# Altium project SFCMasterC.PrjPCB
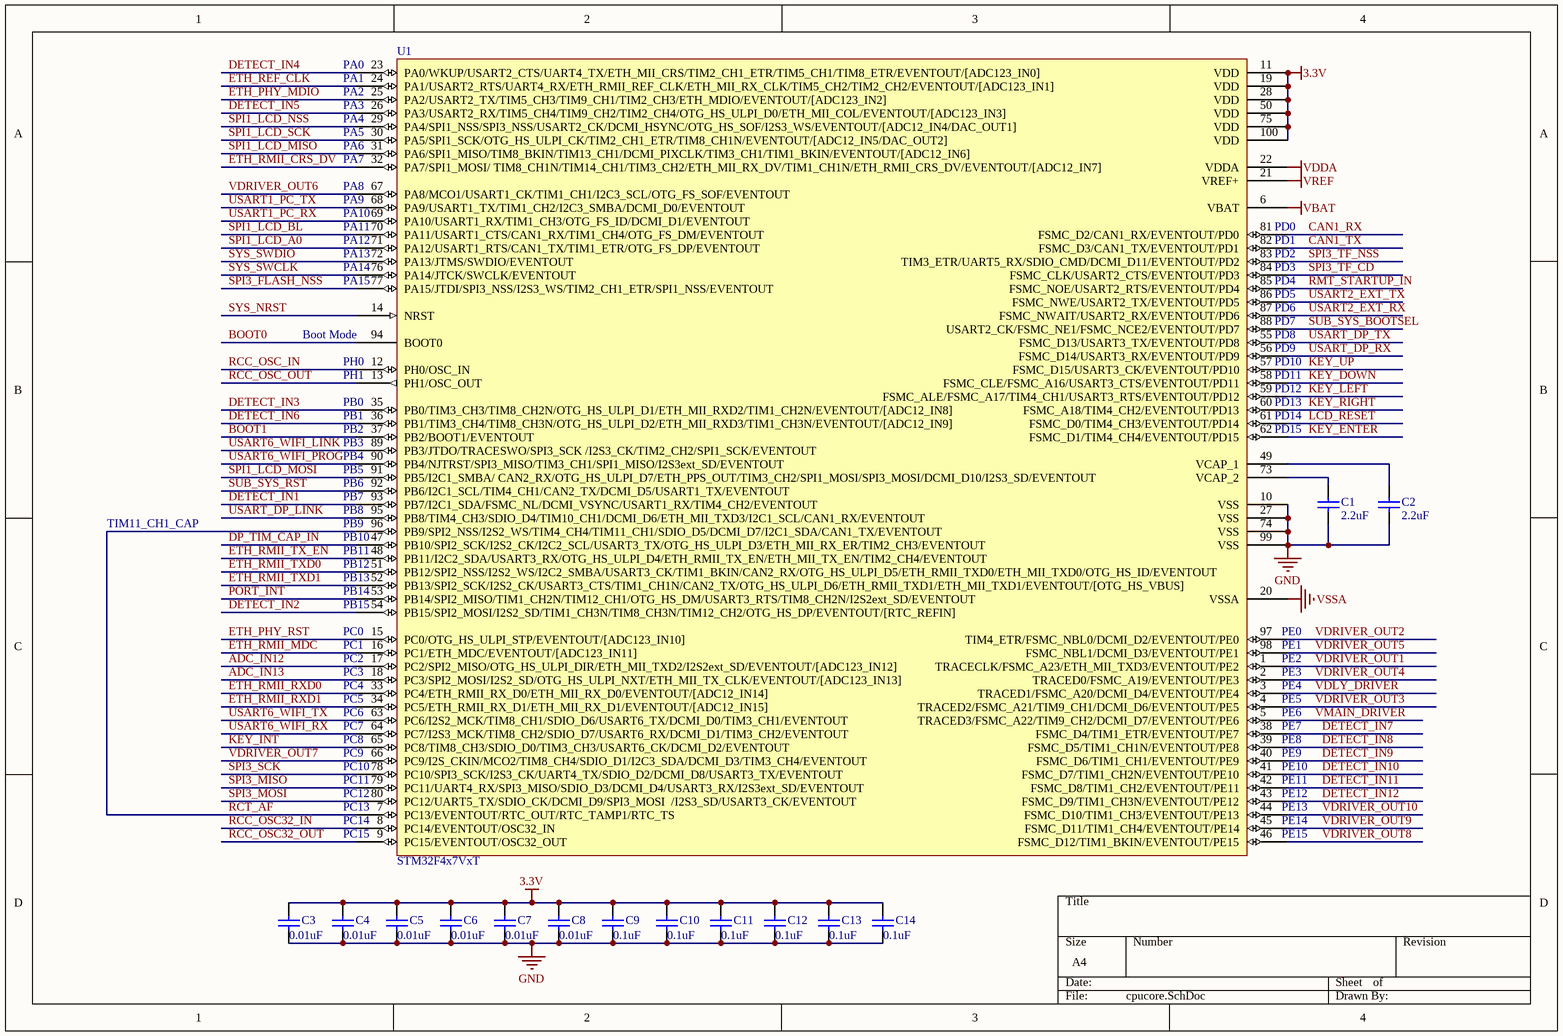
[diagram p0: cpucore.SchDoc]
6 sheets, 178 parts. Net scope: global (net labels, ports and power ports of the same name join across sheets).
Board file: SFCmasterC.PcbDoc
Sheets:
  cpucore.SchDoc
  cpuinterface.SchDoc
  cpuledin.SchDoc
  cpuledout.SchDoc
  cpuadcinput.SchDoc
  cpupwrbackup.SchDoc

## Sheet cpucore.SchDoc
size A4

### Parts
C1  2.2uF  [CAPC2012M]
C2  2.2uF  [CAPC2012M]
C3  0.01uF  [CAPC2012M]
C4  0.01uF  [CAPC2012M]
C5  0.01uF  [CAPC2012M]
C6  0.01uF  [CAPC2012M]
C7  0.01uF  [CAPC2012M]
C8  0.01uF  [CAPC2012M]
C9  0.1uF  [CAPC2012M]
C10  0.1uF  [CAPC2012M]
C11  0.1uF  [CAPC2012M]
C12  0.1uF  [CAPC2012M]
C13  0.1uF  [CAPC2012M]
C14  0.1uF  [CAPC2012M]
U1  STM32F4x7VxT  [LQFP100_L]

### Nets
3.3V: C3.2 C4.2 C5.2 C6.2 C7.2 C8.2 C9.2 C10.2 C11.2 C12.2 C13.2 C14.2 U1.11(VDD) U1.19(VDD) U1.28(VDD) U1.50(VDD) U1.75(VDD) U1.100(VDD)
GND: C1.2 C2.2 C3.1 C4.1 C5.1 C6.1 C7.1 C8.1 C9.1 C10.1 C11.1 C12.1 C13.1 C14.1 U1.10(VSS) U1.20(VSSA) U1.27(VSS) U1.74(VSS) U1.99(VSS)  [also labelled VSSA]
VBAT: U1.6(VBAT)
VDDA: U1.22(VDDA)
VREF: U1.21(VREF+)
ADC_IN12: U1.17(PC2/SPI2_MISO/OTG_HS_ULPI_DIR/ETH_MII_TXD2/I2S2ext_SD/EVENTOUT/[ADC123_IN12])
ADC_IN13: U1.18(PC3/SPI2_MOSI/I2S2_SD/OTG_HS_ULPI_NXT/ETH_MII_TX_CLK/EVENTOUT/[ADC123_IN13])
BOOT0: U1.94(BOOT0)
BOOT1: U1.37(PB2/BOOT1/EVENTOUT)
CAN1_RX: U1.81(FSMC_D2/CAN1_RX/EVENTOUT/PD0)
CAN1_TX: U1.82(FSMC_D3/CAN1_TX/EVENTOUT/PD1)
DETECT_IN1: U1.93(PB7/I2C1_SDA/FSMC_NL/DCMI_VSYNC/USART1_RX/TIM4_CH2/EVENTOUT)
DETECT_IN2: U1.54(PB15/SPI2_MOSI/I2S2_SD/TIM1_CH3N/TIM8_CH3N/TIM12_CH2/OTG_HS_DP/EVENTOUT/[RTC_REFIN])
DETECT_IN3: U1.35(PB0/TIM3_CH3/TIM8_CH2N/OTG_HS_ULPI_D1/ETH_MII_RXD2/TIM1_CH2N/EVENTOUT/[ADC12_IN8])
DETECT_IN4: U1.23(PA0/WKUP/USART2_CTS/UART4_TX/ETH_MII_CRS/TIM2_CH1_ETR/TIM5_CH1/TIM8_ETR/EVENTOUT/[ADC123_IN0])
DETECT_IN5: U1.26(PA3/USART2_RX/TIM5_CH4/TIM9_CH2/TIM2_CH4/OTG_HS_ULPI_D0/ETH_MII_COL/EVENTOUT/[ADC123_IN3])
DETECT_IN6: U1.36(PB1/TIM3_CH4/TIM8_CH3N/OTG_HS_ULPI_D2/ETH_MII_RXD3/TIM1_CH3N/EVENTOUT/[ADC12_IN9])
DETECT_IN7: U1.38(FSMC_D4/TIM1_ETR/EVENTOUT/PE7)
DETECT_IN8: U1.39(FSMC_D5/TIM1_CH1N/EVENTOUT/PE8)
DETECT_IN9: U1.40(FSMC_D6/TIM1_CH1/EVENTOUT/PE9)
DETECT_IN10: U1.41(FSMC_D7/TIM1_CH2N/EVENTOUT/PE10)
DETECT_IN11: U1.42(FSMC_D8/TIM1_CH2/EVENTOUT/PE11)
DETECT_IN12: U1.43(FSMC_D9/TIM1_CH3N/EVENTOUT/PE12)
DP_TIM_CAP_IN: U1.47(PB10/SPI2_SCK/I2S2_CK/I2C2_SCL/USART3_TX/OTG_HS_ULPI_D3/ETH_MII_RX_ER/TIM2_CH3/EVENTOUT)
ETH_PHY_MDIO: U1.25(PA2/USART2_TX/TIM5_CH3/TIM9_CH1/TIM2_CH3/ETH_MDIO/EVENTOUT/[ADC123_IN2])
ETH_PHY_RST: U1.15(PC0/OTG_HS_ULPI_STP/EVENTOUT/[ADC123_IN10])
ETH_REF_CLK: U1.24(PA1/USART2_RTS/UART4_RX/ETH_RMII_REF_CLK/ETH_MII_RX_CLK/TIM5_CH2/TIM2_CH2/EVENTOUT/[ADC123_IN1])
ETH_RMII_CRS_DV: U1.32(PA7/SPI1_MOSI/_TIM8_CH1N/TIM14_CH1/TIM3_CH2/ETH_MII_RX_DV/TIM1_CH1N/ETH_RMII_CRS_DV/EVENTOUT/[ADC12_IN7])
ETH_RMII_MDC: U1.16(PC1/ETH_MDC/EVENTOUT/[ADC123_IN11])
ETH_RMII_RXD0: U1.33(PC4/ETH_RMII_RX_D0/ETH_MII_RX_D0/EVENTOUT/[ADC12_IN14])
ETH_RMII_RXD1: U1.34(PC5/ETH_RMII_RX_D1/ETH_MII_RX_D1/EVENTOUT/[ADC12_IN15])
ETH_RMII_TX_EN: U1.48(PB11/I2C2_SDA/USART3_RX/OTG_HS_ULPI_D4/ETH_RMII_TX_EN/ETH_MII_TX_EN/TIM2_CH4/EVENTOUT)
ETH_RMII_TXD0: U1.51(PB12/SPI2_NSS/I2S2_WS/I2C2_SMBA/USART3_CK/TIM1_BKIN/CAN2_RX/OTG_HS_ULPI_D5/ETH_RMII_TXD0/ETH_MII_TXD0/OTG_HS_ID/EVENTOUT)
ETH_RMII_TXD1: U1.52(PB13/SPI2_SCK/I2S2_CK/USART3_CTS/TIM1_CH1N/CAN2_TX/OTG_HS_ULPI_D6/ETH_RMII_TXD1/ETH_MII_TXD1/EVENTOUT/[OTG_HS_VBUS])
KEY_DOWN: U1.58(FSMC_CLE/FSMC_A16/USART3_CTS/EVENTOUT/PD11)
KEY_ENTER: U1.62(FSMC_D1/TIM4_CH4/EVENTOUT/PD15)
KEY_INT: U1.65(PC8/TIM8_CH3/SDIO_D0/TIM3_CH3/USART6_CK/DCMI_D2/EVENTOUT)
KEY_LEFT: U1.59(FSMC_ALE/FSMC_A17/TIM4_CH1/USART3_RTS/EVENTOUT/PD12)
KEY_RIGHT: U1.60(FSMC_A18/TIM4_CH2/EVENTOUT/PD13)
KEY_UP: U1.57(FSMC_D15/USART3_CK/EVENTOUT/PD10)
LCD_RESET: U1.61(FSMC_D0/TIM4_CH3/EVENTOUT/PD14)
PORT_INT: U1.53(PB14/SPI2_MISO/TIM1_CH2N/TIM12_CH1/OTG_HS_DM/USART3_RTS/TIM8_CH2N/I2S2ext_SD/EVENTOUT)
RCC_OSC32_IN: U1.8(PC14/EVENTOUT/OSC32_IN)
RCC_OSC32_OUT: U1.9(PC15/EVENTOUT/OSC32_OUT)
RCC_OSC_IN: U1.12(PH0/OSC_IN)
RCC_OSC_OUT: U1.13(PH1/OSC_OUT)
RCT_AF: U1.7(PC13/EVENTOUT/RTC_OUT/RTC_TAMP1/RTC_TS) U1.96(PB9/SPI2_NSS/I2S2_WS/TIM4_CH4/TIM11_CH1/SDIO_D5/DCMI_D7/I2C1_SDA/CAN1_TX/EVENTOUT)
RMT_STARTUP_IN: U1.85(FSMC_NOE/USART2_RTS/EVENTOUT/PD4)
SPI1_LCD_A0: U1.71(PA12/USART1_RTS/CAN1_TX/TIM1_ETR/OTG_FS_DP/EVENTOUT)
SPI1_LCD_BL: U1.70(PA11/USART1_CTS/CAN1_RX/TIM1_CH4/OTG_FS_DM/EVENTOUT)
SPI1_LCD_MISO: U1.31(PA6/SPI1_MISO/TIM8_BKIN/TIM13_CH1/DCMI_PIXCLK/TIM3_CH1/TIM1_BKIN/EVENTOUT/[ADC12_IN6])
SPI1_LCD_MOSI: U1.91(PB5/I2C1_SMBA/_CAN2_RX/OTG_HS_ULPI_D7/ETH_PPS_OUT/TIM3_CH2/SPI1_MOSI/SPI3_MOSI/DCMI_D10/I2S3_SD/EVENTOUT)
SPI1_LCD_NSS: U1.29(PA4/SPI1_NSS/SPI3_NSS/USART2_CK/DCMI_HSYNC/OTG_HS_SOF/I2S3_WS/EVENTOUT/[ADC12_IN4/DAC_OUT1])
SPI1_LCD_SCK: U1.30(PA5/SPI1_SCK/OTG_HS_ULPI_CK/TIM2_CH1_ETR/TIM8_CH1N/EVENTOUT/[ADC12_IN5/DAC_OUT2])
SPI3_FLASH_NSS: U1.77(PA15/JTDI/SPI3_NSS/I2S3_WS/TIM2_CH1_ETR/SPI1_NSS/EVENTOUT)
SPI3_MISO: U1.79(PC11/UART4_RX/SPI3_MISO/SDIO_D3/DCMI_D4/USART3_RX/I2S3ext_SD/EVENTOUT)
SPI3_MOSI: U1.80(PC12/UART5_TX/SDIO_CK/DCMI_D9/SPI3_MOSI__/I2S3_SD/USART3_CK/EVENTOUT)
SPI3_SCK: U1.78(PC10/SPI3_SCK/I2S3_CK/UART4_TX/SDIO_D2/DCMI_D8/USART3_TX/EVENTOUT)
SPI3_TF_CD: U1.84(FSMC_CLK/USART2_CTS/EVENTOUT/PD3)
SPI3_TF_NSS: U1.83(TIM3_ETR/UART5_RX/SDIO_CMD/DCMI_D11/EVENTOUT/PD2)
SUB_SYS_BOOTSEL: U1.88(USART2_CK/FSMC_NE1/FSMC_NCE2/EVENTOUT/PD7)
SUB_SYS_RST: U1.92(PB6/I2C1_SCL/TIM4_CH1/CAN2_TX/DCMI_D5/USART1_TX/EVENTOUT)
SYS_NRST: U1.14(NRST)
SYS_SWCLK: U1.76(PA14/JTCK/SWCLK/EVENTOUT)
SYS_SWDIO: U1.72(PA13/JTMS/SWDIO/EVENTOUT)
USART1_PC_RX: U1.69(PA10/USART1_RX/TIM1_CH3/OTG_FS_ID/DCMI_D1/EVENTOUT)
USART1_PC_TX: U1.68(PA9/USART1_TX/TIM1_CH2/I2C3_SMBA/DCMI_D0/EVENTOUT)
USART2_EXT_RX: U1.87(FSMC_NWAIT/USART2_RX/EVENTOUT/PD6)
USART2_EXT_TX: U1.86(FSMC_NWE/USART2_TX/EVENTOUT/PD5)
USART6_WIFI_LINK: U1.89(PB3/JTDO/TRACESWO/SPI3_SCK_/I2S3_CK/TIM2_CH2/SPI1_SCK/EVENTOUT)
USART6_WIFI_PROG: U1.90(PB4/NJTRST/SPI3_MISO/TIM3_CH1/SPI1_MISO/I2S3ext_SD/EVENTOUT)
USART6_WIFI_RX: U1.64(PC7/I2S3_MCK/TIM8_CH2/SDIO_D7/USART6_RX/DCMI_D1/TIM3_CH2/EVENTOUT)
USART6_WIFI_TX: U1.63(PC6/I2S2_MCK/TIM8_CH1/SDIO_D6/USART6_TX/DCMI_D0/TIM3_CH1/EVENTOUT)
USART_DP_LINK: U1.95(PB8/TIM4_CH3/SDIO_D4/TIM10_CH1/DCMI_D6/ETH_MII_TXD3/I2C1_SCL/CAN1_RX/EVENTOUT)
USART_DP_RX: U1.56(FSMC_D14/USART3_RX/EVENTOUT/PD9)
USART_DP_TX: U1.55(FSMC_D13/USART3_TX/EVENTOUT/PD8)
VDLY_DRIVER: U1.3(TRACED1/FSMC_A20/DCMI_D4/EVENTOUT/PE4)
VDRIVER_OUT1: U1.1(TRACECLK/FSMC_A23/ETH_MII_TXD3/EVENTOUT/PE2)
VDRIVER_OUT2: U1.97(TIM4_ETR/FSMC_NBL0/DCMI_D2/EVENTOUT/PE0)
VDRIVER_OUT3: U1.4(TRACED2/FSMC_A21/TIM9_CH1/DCMI_D6/EVENTOUT/PE5)
VDRIVER_OUT4: U1.2(TRACED0/FSMC_A19/EVENTOUT/PE3)
VDRIVER_OUT5: U1.98(FSMC_NBL1/DCMI_D3/EVENTOUT/PE1)
VDRIVER_OUT6: U1.67(PA8/MCO1/USART1_CK/TIM1_CH1/I2C3_SCL/OTG_FS_SOF/EVENTOUT)
VDRIVER_OUT7: U1.66(PC9/I2S_CKIN/MCO2/TIM8_CH4/SDIO_D1/I2C3_SDA/DCMI_D3/TIM3_CH4/EVENTOUT)
VDRIVER_OUT8: U1.46(FSMC_D12/TIM1_BKIN/EVENTOUT/PE15)
VDRIVER_OUT9: U1.45(FSMC_D11/TIM1_CH4/EVENTOUT/PE14)
VDRIVER_OUT10: U1.44(FSMC_D10/TIM1_CH3/EVENTOUT/PE13)
VMAIN_DRIVER: U1.5(TRACED3/FSMC_A22/TIM9_CH2/DCMI_D7/EVENTOUT/PE6)
NetC1_1: C1.1 U1.73(VCAP_2)
NetC2_1: C2.1 U1.49(VCAP_1)

### Notes on the sheet
- (near U1) PA0
- (near U1) PA1
- (near U1) PA2
- (near U1) PA3
- (near U1) PA4
- (near U1) PA5
- (near U1) PA6
- (near U1) PA7
- (near U1) PA8
- (near U1) PA9
- (near U1) PA10
- (near U1) PA11
- (near U1) PA12
- (near U1) PD1
- (near U1) PD0
- (near U1) PA13
- (near U1) PA14
- (near U1) PA15
- (near U1) PD3
- (near U1) PD5
- (near U1) PD2
- (near U1) PD4
- (near U1) PD6
- (near U1) Boot Mode
- (near U1) PH1
- (near U1) PH0
- (near U1) PD11
- (near U1) PD10
- (near U1) PD9
- (near U1) PD8
- (near U1) PD7
- (near U1) PB2
- (near U1) PB3
- (near U1) PB0
- (near U1) PB1
- (near U1) PD12
- (near U1) PD13
- (near U1) PD14
- (near U1) PD15
- (near U1) PB4
- (near U1) PB5
- (near U1) PB6
- (near U1) PB7
- (near U1) PB8
- TIM11_CH1_CAP
- (near U1) PB11
- (near U1) PB12
- (near U1) PB13
- (near U1) PB10
- (near U1) PB9
- (near U1) PB14
- (near U1) PB15
- (near U1) PC0
- (near U1) PC1
- (near U1) PE0
- (near U1) PE1
- (near U1) PC4
- (near U1) PC5
- (near U1) PC2
- (near U1) PC3
- (near U1) PC6
- (near U1) PE2
- (near U1) PE3
- (near U1) PE4
- (near U1) PE5
- (near U1) PE6
- (near U1) PC10
- (near U1) PC11
- (near U1) PC7
- (near U1) PC8
- (near U1) PC9
- (near U1) PE7
- (near U1) PE8
- (near U1) PE9
- (near U1) PE10
- (near U1) PE11
- (near U1) PC14
- (near U1) PC15
- (near U1) PC12
- (near U1) PC13
- (near U1) PE12
- (near U1) PE13
- (near U1) PE14
- (near U1) PE15

### Library data of the parts
C1-C14 = Cap: Capacitor; Value: 1nF; Published: 8-Jun-2000; LatestRevisionDate: 17-Jul-2002; LatestRevisionNote: Re-released for DXP Platform.; PackageReference: RAD-0.3; Publisher: Altium Limited
U1 = STM32F4x7VxT: STM32 ARM-based 32-bit MCU with 64 Kbytes Flash, 100-pin LQFP, Industrial Temperature; ComponentLink1Description: Manufacturer Link; ComponentLink2Description: Datasheet; ComponentLink2URL: http://www.st.com/stonline/products/literature/ds/13587.pdf; DatasheetVersion: rev6, Mar-2008; PackageDescription: 100-Pin Low-Profile Quad Flat Pack, 14 x 14 mm Body, 0.5 mm Pitch (LQFP100); PackageReference: LQFP100; PackageVersion: Mar-2008; Published: 30-May-2008; Publisher: Altium Limited; ComponentLink1URL: www.st.com/stm32

## Sheet cpuinterface.SchDoc
size A4
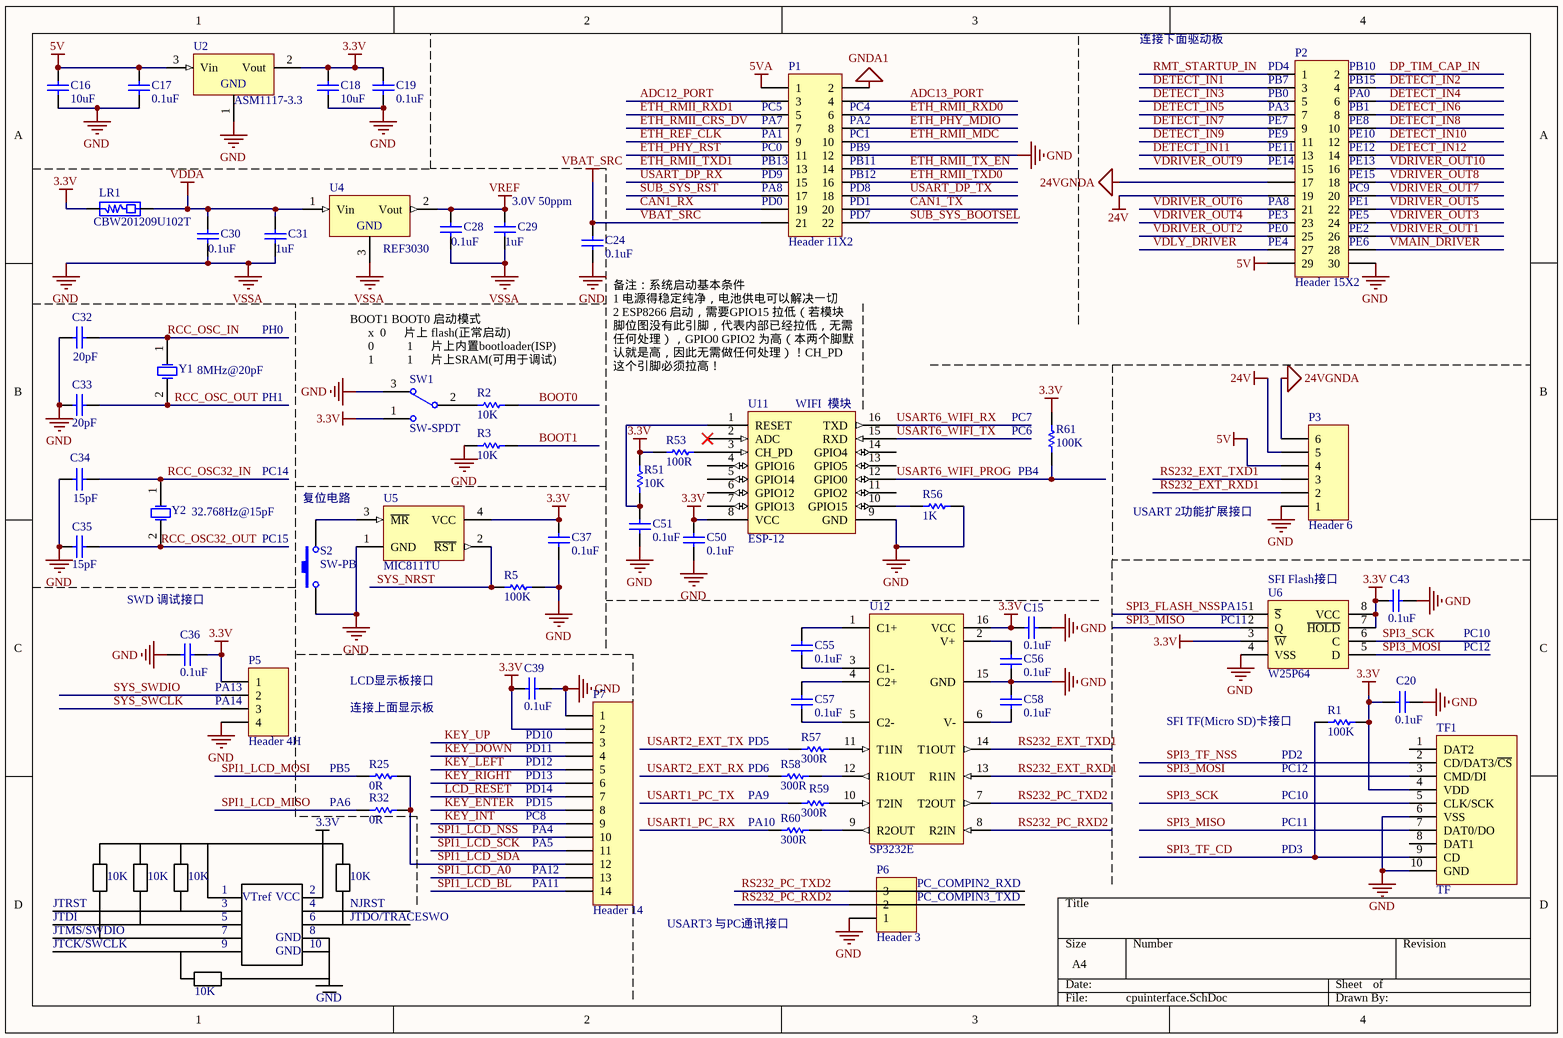
[diagram p1: cpuinterface.SchDoc]

### Parts
C15  0.1uF  [CAPC2012M]
C16  10uF  [CAPC2012M]
C17  0.1uF  [CAPC2012M]
C18  10uF  [CAPC2012M]
C19  0.1uF  [CAPC2012M]
C20  0.1uF  [CAPC2012M]
C24  0.1uF  [CAPC2012M]
C28  0.1uF  [CAPC2012M]
C29  1uF  [CAPC2012M]
C30  0.1uF  [CAPC2012M]
C31  1uF  [CAPC2012M]
C32  20pF  [CAPC2012M]
C33  20pF  [CAPC2012M]
C34  15pF  [CAPC2012M]
C35  15pF  [CAPC2012M]
C36  0.1uF  [CAPC2012M]
C37  0.1uF  [CAPC2012M]
C39  0.1uF  [CAPC2012M]
C43  0.1uF  [CAPC2012M]
C50  0.1uF  [CAPC2012M]
C51  0.1uF  [CAPC2012M]
C55  0.1uF  [CAPC2012M]
C56  0.1uF  [CAPC2012M]
C57  0.1uF  [CAPC2012M]
C58  0.1uF  [CAPC2012M]
LR1  CBW201209U102T  [INDC2012M]
P1  Header 11X2  [HDR2X11]
P2  Header 15X2  [HDR2X15]
P3  Header 6  [HDR1x6-2.0]
P5  Header 4H  [HDR1X4H-2.0]
P6  Header 3  [HDR1x3-2.0]
P7  Header 14  [FPC0.5-14P-A]
R1  100K  [RESC2012M]
R2  10K  [RESC2012M]
R3  10K  [RESC2012M]
R5  100K  [RESC2012M]
R25  0R  [RESC2012M]
R32  0R  [RESC2012M]
R51  10K  [RESC2012M]
R53  100R  [RESC2012M]
R56  1K  [RESC2012M]
R57  300R  [RESC2012M]
R58  300R  [RESC2012M]
R59  300R  [RESC2012M]
R60  300R  [RESC2012M]
R61  100K  [RESC2012M]
S2  SW-PB  [PBSMT-6x3x3.5R]
SW1  SW-SPDT  [SW-9x3.5x3.5RS]
TF1  TF  [TF-PUSH]
U2  ASM1117-3.3  [SOT-223]
U4  REF3030  [SOT23_M]
U5  MIC811TU  [SOT-143_N]
U6  W25P64  [SOIC8_W]
U11  ESP-12  [ESP-12]
U12  SP3232E  [NSO16_M]
Y1  8MHz@20pF  [HC-49U]
Y2  32.768Hz@15pF  [HC-RTC-L]

### Nets
3.3V: C15.2 C18.2 C19.2 C20.1 C36.2 C37.2 C39.2 C43.1 C50.1 LR1.1 P5.1 P7.2 R1.2 R51.1 R53.1 R61.1 SW1.1 TF1.4(VDD) U2.2(Vout) U5.4(VCC) U6.3(~{W}) U6.7(~{HOLD}) U6.8(VCC) U11.8(VCC) U12.16(VCC)
5V: C16.2 C17.2 P2.29 P3.4 U2.3(Vin)
5VA: P1.1
24V: P2.19 P3.5
24VGNDA: P2.17 P3.6
GND: C15.1 C16.1 C17.1 C18.1 C19.1 C20.2 C24.2 C28.1 C29.1 C30.1 C31.1 C32.2 C33.2 C34.2 C35.2 C36.1 C37.1 C39.1 C43.2 C50.2 C51.2 C56.1 C58.2 P1.12 P2.30 P3.1 P5.4 P6.1 P7.1 R3.2 R5.2 R56.1 S2.1 SW1.3 TF1.6(VSS) TF1.10(GND) U2.1(GND) U4.3(GND) U5.1(GND) U6.4(VSS) U11.9(GND) U12.15(GND)  [also labelled VSSA]
GNDA1: P1.2  [project net GNDA]
VBAT_SRC: C24.1 P1.21
VDDA: C30.2 C31.2 LR1.2 U4.1(Vin)
VREF: C28.2 C29.2 U4.2(Vout)
ADC12_PORT: P1.3
ADC13_PORT: P1.4
BOOT0: R2.1
BOOT1: R3.1
CAN1_RX: P1.19
CAN1_TX: P1.20
DETECT_IN1: P2.3
DETECT_IN2: P2.4
DETECT_IN3: P2.5
DETECT_IN4: P2.6
DETECT_IN5: P2.7
DETECT_IN6: P2.8
DETECT_IN7: P2.9
DETECT_IN8: P2.10
DETECT_IN9: P2.11
DETECT_IN10: P2.12
DETECT_IN11: P2.13
DETECT_IN12: P2.14
DP_TIM_CAP_IN: P2.2
ETH_PHY_MDIO: P1.8
ETH_PHY_RST: P1.11
ETH_REF_CLK: P1.9
ETH_RMII_CRS_DV: P1.7
ETH_RMII_MDC: P1.10
ETH_RMII_RXD0: P1.6
ETH_RMII_RXD1: P1.5
ETH_RMII_TX_EN: P1.14
ETH_RMII_TXD0: P1.16
ETH_RMII_TXD1: P1.13
KEY_DOWN: P7.4
KEY_ENTER: P7.8
KEY_INT: P7.9
KEY_LEFT: P7.5
KEY_RIGHT: P7.6
KEY_UP: P7.3
LCD_RESET: P7.7
RCC_OSC32_IN: C34.1 Y2.1(OSC1)
RCC_OSC32_OUT: C35.1 Y2.2(OSC2)
RCC_OSC_IN: C32.1 Y1.1(OSC1)
RCC_OSC_OUT: C33.1 Y1.2(OSC2)
RMT_STARTUP_IN: P2.1
RS232_EXT_RXD1: P3.2 U12.13(R1IN)
RS232_EXT_TXD1: P3.3 U12.14(T1OUT)
RS232_PC_RXD2: P6.2 U12.8(R2IN)
RS232_PC_TXD2: P6.3 U12.7(T2OUT)
SPI1_LCD_A0: P7.13
SPI1_LCD_BL: P7.14
SPI1_LCD_MISO: R32.1
SPI1_LCD_MOSI: R25.1
SPI1_LCD_NSS: P7.10
SPI1_LCD_SCK: P7.11
SPI1_LCD_SDA: P7.12 R25.2 R32.2
SPI3_FLASH_NSS: U6.1(~{S})
SPI3_MISO: TF1.7(DAT0/DO) U6.2(Q)
SPI3_MOSI: TF1.3(CMD/DI) U6.5(D)
SPI3_SCK: TF1.5(CLK/SCK) U6.6(C)
SPI3_TF_CD: R1.1 TF1.9(CD)
SPI3_TF_NSS: TF1.2(CD/DAT3/~{CS})
SUB_SYS_BOOTSEL: P1.22
SUB_SYS_RST: P1.17
SYS_NRST: R5.1 U5.2(~{RST})
SYS_SWCLK: P5.3
SYS_SWDIO: P5.2
USART1_PC_RX: R60.2
USART1_PC_TX: R59.1
USART2_EXT_RX: R58.1
USART2_EXT_TX: R57.1
USART6_WIFI_PROG: R61.2 U11.12(GPIO0)
USART6_WIFI_RX: U11.16(TXD)
USART6_WIFI_TX: U11.15(RXD)
USART_DP_RX: P1.15
USART_DP_TX: P1.18
VDLY_DRIVER: P2.27
VDRIVER_OUT1: P2.26
VDRIVER_OUT2: P2.25
VDRIVER_OUT3: P2.24
VDRIVER_OUT4: P2.23
VDRIVER_OUT5: P2.22
VDRIVER_OUT6: P2.21
VDRIVER_OUT7: P2.20
VDRIVER_OUT8: P2.18
VDRIVER_OUT9: P2.15
VDRIVER_OUT10: P2.16
VMAIN_DRIVER: P2.28
NetC51_1: C51.1 R51.2 U11.1(RESET)
NetC55_1: C55.1 U12.1(C1+)
NetC55_2: C55.2 U12.3(C1-)
NetC56_2: C56.2 U12.2(V+)
NetC57_1: C57.1 U12.5(C2-)
NetC57_2: C57.2 U12.4(C2+)
NetC58_1: C58.1 U12.6(V-)
NetR2_2: R2.2 SW1.2
NetR53_2: R53.2 U11.3(CH_PD)
NetR56_2: R56.2 U11.10(GPIO15)
NetR57_2: R57.2 U12.11(T1IN)
NetR58_2: R58.2 U12.12(R1OUT)
NetR59_2: R59.2 U12.10(T2IN)
NetR60_1: R60.1 U12.9(R2OUT)
NetS2_2: S2.2 U5.3(~{MR})

Not connected (* = marked no-connect by the designer): TF1 1(DAT2) 8(DAT1); U11 2(ADC)* 4(GPIO16) 5(GPIO14) 6(GPIO12) 7(GPIO13) 11(GPIO2) 13(GPIO5) 14(GPIO4)

### Notes on the sheet
- 连接下面驱动板
- (near P1) PC5
- (near P1) PC4
- (near P2) PB7
- (near P2) PD4
- (near P2) PA3
- (near P2) PB0
- (near P2) PB10
- (near P2) PB1
- (near P2) PA0
- (near P2) PB15
- (near P1) PA1
- (near P1) PA7
- (near P1) PB13
- (near P1) PC0
- (near P1) PD9
- (near P1) PA2
- (near P1) PB11
- (near P1) PB12
- (near P1) PC1
- (near P1) PB9
- (near P2) PE14
- (near P2) PE11
- (near P2) PE9
- (near P2) PE7
- (near P2) PE15
- (near P2) PE12
- (near P2) PE13
- (near P2) PE10
- (near P2) PE8
- (near C29) 3.0V 50ppm
- (near P1) PA8
- (near P1) PD0
- (near P1) PD8
- (near P1) PD1
- (near P1) PD7
- (near P2) PE4
- (near P2) PE0
- (near P2) PE3
- (near P2) PA8
- (near P2) PE6
- (near P2) PE2
- (near P2) PE5
- (near P2) PE1
- (near P2) PC9
- PH0
- BOOT1 BOOT0 启动模式
  x	 0      片上 flash(正常启动)
  0           1      片上内置bootloader(ISP)
  1           1      片上SRAM(可用于调试)
- PH1
- 备注：系统启动基本条件
  1 电源得稳定纯净，电池供电可以解决一切
  2 ESP8266 启动，需要GPIO15 拉低（若模块脚位图没有此引脚，代表内部已经拉低，无需任何处理），GPIO0 GPIO2 为高（本两个脚默认就是高，因此无需做任何处理）！CH_PD 这个引脚必须拉高！
- (near U11) WIFI  模块
- (near R61) PC6
- (near R61) PC7
- PC14
- 复位电路
- (near R61) PB4
- USART 2功能扩展接口
- (near S2) PC15
- (near U6) SFI Flash接口
- SWD 调试接口
- (near U6) PC11
- (near U6) PA15
- PC10
- PC12
- (near P5) PA13
- (near P5) PA14
- LCD显示板接口
- 连接上面显示板
- (near R25) PB5
- PD12
- PD11
- PD10
- (near P7) PD13
- (near P7) PD14
- PD5
- (near R58) PD6
- SFI TF(Micro SD)卡接口
- (near R1) PD2
- (near R1) PC12
- (near R32) 3.3V
- PA6
- (near P7) PD15
- (near P7) PC8
- (near P7) PA4
- (near P7) PA5
- (near R60) PA10
- PA9
- PD3
- PC11
- JTRST
- JTDI
- 10K
- 1
- 3
- 5
- VTref
- VCC
- 2
- 4
- 6
- NJRST
- JTDO/TRACESWO
- (near P7) PA11
- (near P7) PA12
- USART3 与PC通讯接口
- PC_COMPIN2_RXD
- PC_COMPIN3_TXD
- JTMS/SWDIO
- JTCK/SWCLK
- 7
- 9
- GND
- 8
- 10

### Library data of the parts
C15-C20 C24 C28-C31 C36 C37 C39 C43 C50 C51 C55-C58 = Cap: Capacitor; Value: 1nF; Published: 8-Jun-2000; LatestRevisionDate: 17-Jul-2002; LatestRevisionNote: Re-released for DXP Platform.; PackageReference: RAD-0.3; Publisher: Altium Limited
C32-C35 = Cap: Capacitor; Value: 100pF; Published: 8-Jun-2000; LatestRevisionDate: 17-Jul-2002; LatestRevisionNote: Re-released for DXP Platform.; PackageReference: RAD-0.3; Publisher: Altium Limited
LR1 = BLM10/11/21/31/41: EMI FILTERS,DC Resistance max.0.05~1.5 ohms,10 ~ 1000 ohms at 100MHz  Frequency
P1 = Header 11X2: Header, 11-Pin, Dual row; LatestRevisionDate: 17-Jul-2002; LatestRevisionNote: Re-released for DXP Platform.; Publisher: Altium Limited
P2 = Header 15X2: Header, 15-Pin, Dual row; LatestRevisionDate: 17-Jul-2002; LatestRevisionNote: Re-released for DXP Platform.; Publisher: Altium Limited
P3 = Header 6: Header, 6-Pin; LatestRevisionDate: 17-Jul-2002; LatestRevisionNote: Re-released for DXP Platform.; Publisher: Altium Limited
P5 = Header 4H: Header, 4-Pin, Right Angle; LatestRevisionDate: 17-Jul-2002; LatestRevisionNote: Re-released for DXP Platform.; Publisher: Altium Limited
P6 = Header 3: Header, 3-Pin; LatestRevisionDate: 17-Jul-2002; LatestRevisionNote: Re-released for DXP Platform.; Publisher: Altium Limited
P7 = Header 14: Header, 14-Pin; LatestRevisionDate: 17-Jul-2002; LatestRevisionNote: Re-released for DXP Platform.; Publisher: Altium Limited
R1 R5 R25 R32 R53 R56-R61 = Res1: Resistor; Value: 10K; Published: 8-Jun-2000; LatestRevisionDate: 17-Jul-2002; LatestRevisionNote: Re-released for DXP Platform.; PackageReference: AXIAL-0.3; Publisher: Altium Limited
R2 R3 R51 = Res1: Resistor; Published: 8-Jun-2000; LatestRevisionDate: 17-Jul-2002; LatestRevisionNote: Re-released for DXP Platform.; PackageReference: AXIAL-0.3; Publisher: Altium Limited; Value: 10K
S2 = SW-PB: Push Button ,2mm(L)x2mm(W)x10mm(H); Published: 24-Mar-1999; LatestRevisionDate: 17-Jul-2002; LatestRevisionNote: Re-released for DXP Platform.; PackageReference: SPST-2; Publisher: Altium Limited
SW1 = SW-SPDT_1: 开关; Published: 24-Mar-1999; LatestRevisionDate: 17-Dec-2003; LatestRevisionNote: Schematic revised, PCB Footprint replaced.; DatasheetDocument: 05-Dec-2000; PackageReference: TL36WW15050; Publisher: Altium Limited; ComponentLink1Description: Manufacturer Link; ComponentLink1URL: http://www.apem.com
U2 = LM1117T-5.0: 800mA Low-Dropout Linear Regulator
U4 = REF3330: 1.25V 1.8V 2.048V 2.5V 3.0V 3.3V 4.096V reference voltage
U5 = MAX811-EUS-T: 4-Pin 礟 Voltage Monitors with Manual Reset Input; Published: 16-Jan-2001; LatestRevisionDate: 29-May-2009; LatestRevisionNote: IPC-7351 Footprint Added.; DatasheetVersion: Feb-1998; PackageVersion: Feb-1998; PackageReference: SOT143; Publisher: Altium Limited; PackageDescription: 4-Pin SOT-143 Package 1.9 mm Pitch, 2.3 mm Lead Span; ComponentLink1Description: Manufacturer Link; ComponentLink1URL: http://www.maxim-ic.com/; ComponentLink2Description: Datasheet; ComponentLink2URL: http://pdfserv.maxim-ic.com/en/ds/MAX811-MAX812.pdf
U6 = M25P32: 32 Mbit, Low Voltage, Serial Flash Memory  With 50MHz SPI Bus Interface
U11 = ESP-12: SOC Wifi Mode
U12 = SP3232E: +3.0V+5V Powered, Multi-Channel RS-232 Driver/Receiver; Published: 16-Jan-2001; LatestRevisionDate: 13-Apr-2006; LatestRevisionNote: IPC-7351 Footprint Added.; PackageReference: NSO16; Publisher: Altium Limited; PackageDescription: 16-Pin Small Outline Integrated Circuit 1.27 mm Pitch; Code_JEDEC: MS-012-AC; Code_IPC: SOIC127P600-16; ComponentLink1Description: Manufacturer Link; ComponentLink1URL: http://www.maxim-ic.com/; ComponentLink2Description: Datasheet; ComponentLink2URL: http://pdfserv.maxim-ic.com/en/ds/MAX220-MAX249.pdf
Y1 Y2 = XTAL: Crystal Oscillator; Published: 8-Jun-2000; LatestRevisionDate: 17-Jul-2002; LatestRevisionNote: Re-released for DXP Platform.; PackageReference: R38; Publisher: Altium Limited

## Sheet cpuledin.SchDoc
size A4
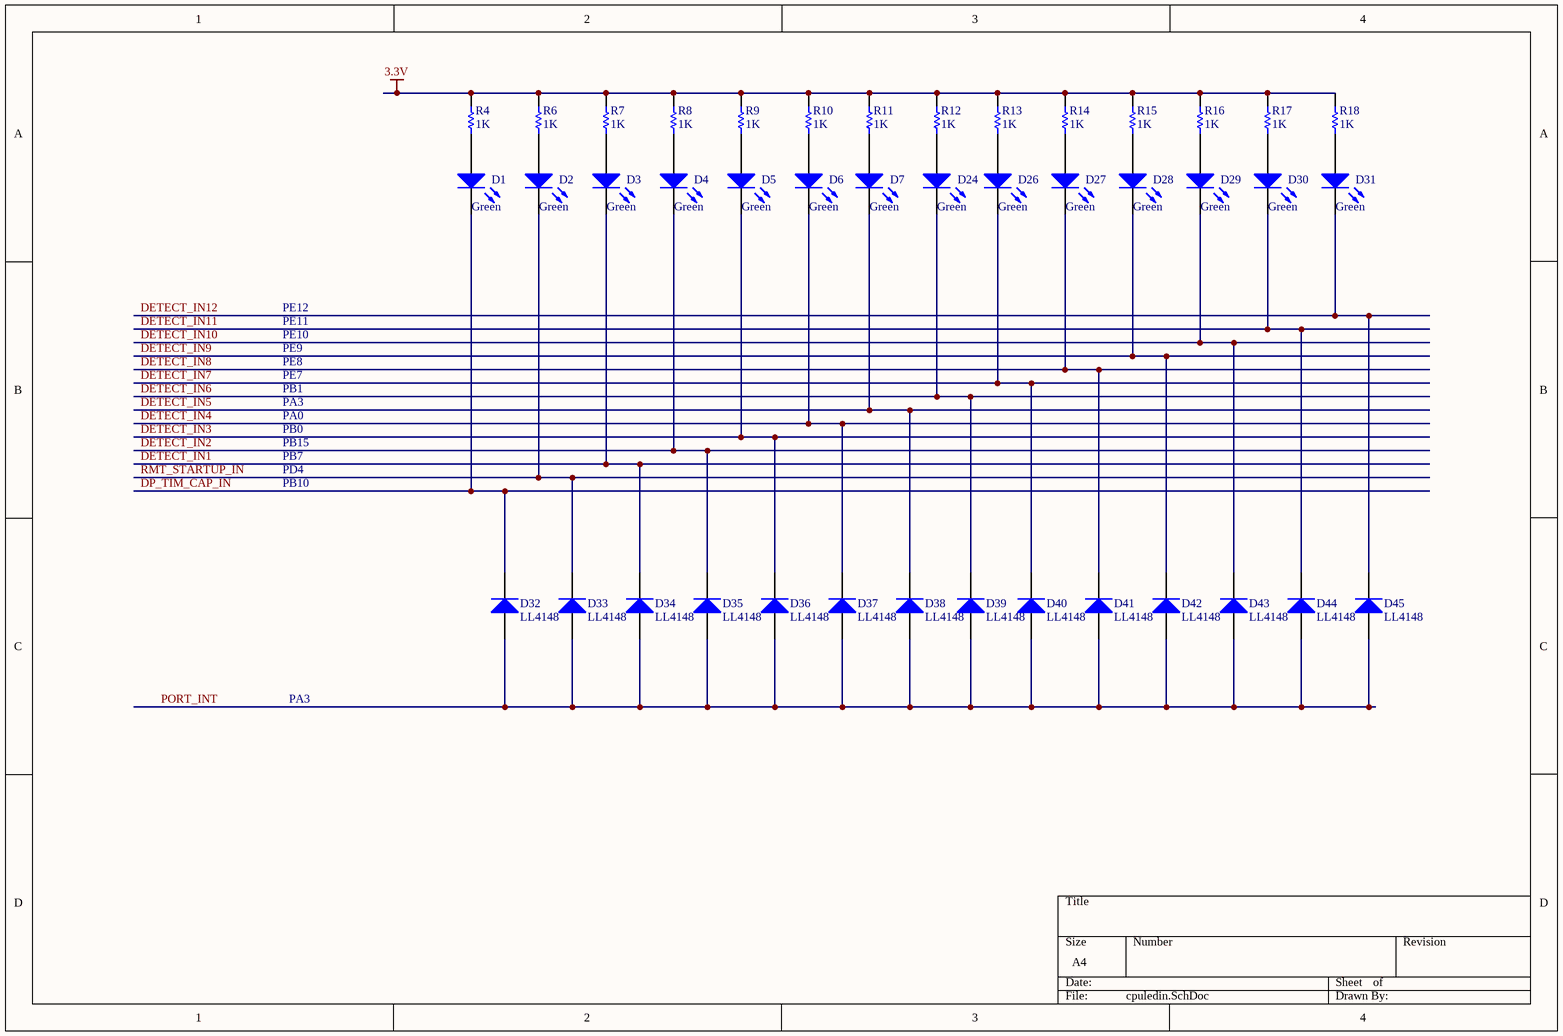
[diagram p2: cpuledin.SchDoc]

### Parts
D1  Green  [CD2012-0805]
D2  Green  [CD2012-0805]
D3  Green  [CD2012-0805]
D4  Green  [CD2012-0805]
D5  Green  [CD2012-0805]
D6  Green  [CD2012-0805]
D7  Green  [CD2012-0805]
D24  Green  [CD2012-0805]
D26  Green  [CD2012-0805]
D27  Green  [CD2012-0805]
D28  Green  [CD2012-0805]
D29  Green  [CD2012-0805]
D30  Green  [CD2012-0805]
D31  Green  [CD2012-0805]
D32  LL4148  [CD2012-0805]
D33  LL4148  [CD2012-0805]
D34  LL4148  [CD2012-0805]
D35  LL4148  [CD2012-0805]
D36  LL4148  [CD2012-0805]
D37  LL4148  [CD2012-0805]
D38  LL4148  [CD2012-0805]
D39  LL4148  [CD2012-0805]
D40  LL4148  [CD2012-0805]
D41  LL4148  [CD2012-0805]
D42  LL4148  [CD2012-0805]
D43  LL4148  [CD2012-0805]
D44  LL4148  [CD2012-0805]
D45  LL4148  [CD2012-0805]
R4  1K  [RESC2012M]
R6  1K  [RESC2012M]
R7  1K  [RESC2012M]
R8  1K  [RESC2012M]
R9  1K  [RESC2012M]
R10  1K  [RESC2012M]
R11  1K  [RESC2012M]
R12  1K  [RESC2012M]
R13  1K  [RESC2012M]
R14  1K  [RESC2012M]
R15  1K  [RESC2012M]
R16  1K  [RESC2012M]
R17  1K  [RESC2012M]
R18  1K  [RESC2012M]

### Nets
3.3V: R4.2 R6.2 R7.2 R8.2 R9.2 R10.2 R11.2 R12.2 R13.2 R14.2 R15.2 R16.2 R17.2 R18.2
DETECT_IN1: D3.2(K) D34.2(K)
DETECT_IN2: D4.2(K) D35.2(K)
DETECT_IN3: D5.2(K) D36.2(K)
DETECT_IN4: D6.2(K) D37.2(K)
DETECT_IN5: D7.2(K) D38.2(K)
DETECT_IN6: D24.2(K) D39.2(K)
DETECT_IN7: D26.2(K) D40.2(K)
DETECT_IN8: D27.2(K) D41.2(K)
DETECT_IN9: D28.2(K) D42.2(K)
DETECT_IN10: D29.2(K) D43.2(K)
DETECT_IN11: D30.2(K) D44.2(K)
DETECT_IN12: D31.2(K) D45.2(K)
DP_TIM_CAP_IN: D1.2(K) D32.2(K)
PORT_INT: D32.1(A) D33.1(A) D34.1(A) D35.1(A) D36.1(A) D37.1(A) D38.1(A) D39.1(A) D40.1(A) D41.1(A) D42.1(A) D43.1(A) D44.1(A) D45.1(A)
RMT_STARTUP_IN: D2.2(K) D33.2(K)
NetD1_1: D1.1(A) R4.1
NetD2_1: D2.1(A) R6.1
NetD3_1: D3.1(A) R7.1
NetD4_1: D4.1(A) R8.1
NetD5_1: D5.1(A) R9.1
NetD6_1: D6.1(A) R10.1
NetD7_1: D7.1(A) R11.1
NetD24_1: D24.1(A) R12.1
NetD26_1: D26.1(A) R13.1
NetD27_1: D27.1(A) R14.1
NetD28_1: D28.1(A) R15.1
NetD29_1: D29.1(A) R16.1
NetD30_1: D30.1(A) R17.1
NetD31_1: D31.1(A) R18.1

### Notes on the sheet
- PE12
- PE7
- PE8
- PE9
- PE10
- PE11
- PB15
- PB0
- PA0
- PB1
- PA3
- PB7
- PD4
- PB10

### Library data of the parts
D1-D7 D24 D26-D31 = LED1: Green LED,Output indicate.; Published: 8-Jun-2000; LatestRevisionDate: 08-Jul-2005; LatestRevisionNote: Mech Layer 1 removed.; PackageReference: LED-1; Publisher: Altium Limited
D32-D45 = Diode 1N4007: 1 Amp General Purpose Rectifier; Published: 8-Jun-2000; LatestRevisionDate: 17-Jul-2002; LatestRevisionNote: Re-released for DXP Platform.; DatasheetVersion: 1998; PackageVersion: Aug-1999; PackageReference: DO-41; Publisher: Altium Limited; Code_JEDEC: DO-204-AL; ComponentLink1Description: Manufacturer Link; ComponentLink1URL: http://www.fairchildsemi.com/; ComponentLink2Description: Datasheet; ComponentLink2URL: http://www.fairchildsemi.com/ds/1N%2F1N4001.pdf
R4 R6-R18 = Res1: Resistor; Value: 10K; Published: 8-Jun-2000; LatestRevisionDate: 17-Jul-2002; LatestRevisionNote: Re-released for DXP Platform.; PackageReference: AXIAL-0.3; Publisher: Altium Limited

## Sheet cpuledout.SchDoc
size A4
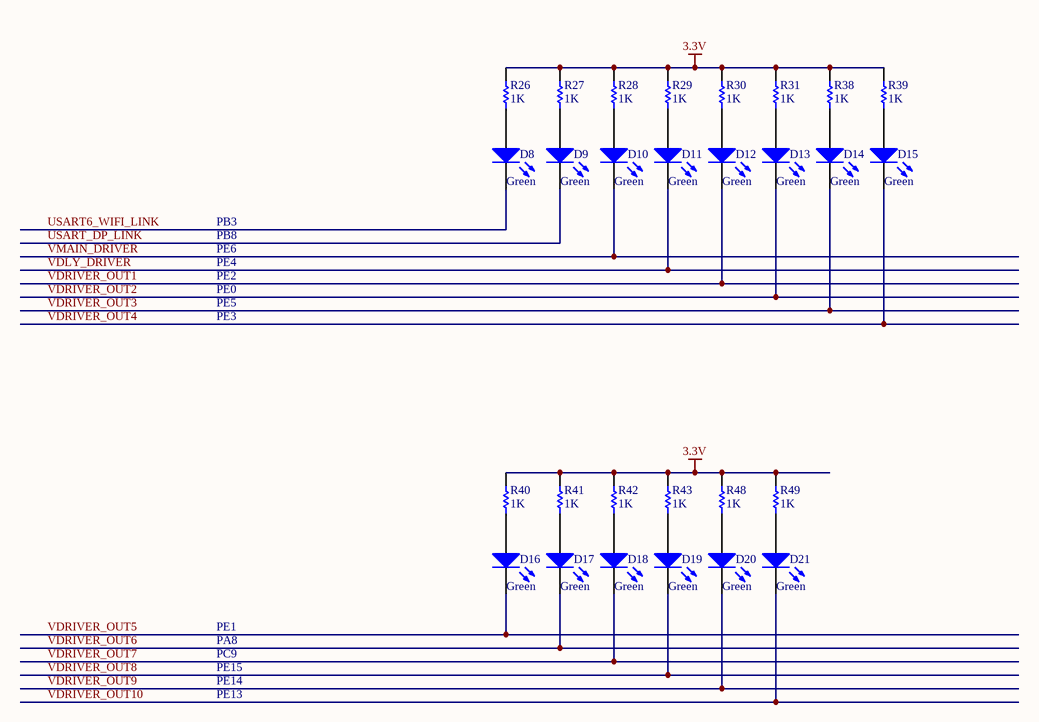
[diagram p3: cpuledout.SchDoc]

### Parts
D8  Green  [CD2012-0805]
D9  Green  [CD2012-0805]
D10  Green  [CD2012-0805]
D11  Green  [CD2012-0805]
D12  Green  [CD2012-0805]
D13  Green  [CD2012-0805]
D14  Green  [CD2012-0805]
D15  Green  [CD2012-0805]
D16  Green  [CD2012-0805]
D17  Green  [CD2012-0805]
D18  Green  [CD2012-0805]
D19  Green  [CD2012-0805]
D20  Green  [CD2012-0805]
D21  Green  [CD2012-0805]
R26  1K  [RESC2012M]
R27  1K  [RESC2012M]
R28  1K  [RESC2012M]
R29  1K  [RESC2012M]
R30  1K  [RESC2012M]
R31  1K  [RESC2012M]
R38  1K  [RESC2012M]
R39  1K  [RESC2012M]
R40  1K  [RESC2012M]
R41  1K  [RESC2012M]
R42  1K  [RESC2012M]
R43  1K  [RESC2012M]
R48  1K  [RESC2012M]
R49  1K  [RESC2012M]

### Nets
3.3V: R26.1 R27.1 R28.1 R29.1 R30.1 R31.1 R38.1 R39.1 R40.1 R41.1 R42.1 R43.1 R48.1 R49.1
USART6_WIFI_LINK: D8.2(K)
USART_DP_LINK: D9.2(K)
VDLY_DRIVER: D11.2(K)
VDRIVER_OUT1: D12.2(K)
VDRIVER_OUT2: D13.2(K)
VDRIVER_OUT3: D14.2(K)
VDRIVER_OUT4: D15.2(K)
VDRIVER_OUT5: D16.2(K)
VDRIVER_OUT6: D17.2(K)
VDRIVER_OUT7: D18.2(K)
VDRIVER_OUT8: D19.2(K)
VDRIVER_OUT9: D20.2(K)
VDRIVER_OUT10: D21.2(K)
VMAIN_DRIVER: D10.2(K)
NetD8_1: D8.1(A) R26.2
NetD9_1: D9.1(A) R27.2
NetD10_1: D10.1(A) R28.2
NetD11_1: D11.1(A) R29.2
NetD12_1: D12.1(A) R30.2
NetD13_1: D13.1(A) R31.2
NetD14_1: D14.1(A) R38.2
NetD15_1: D15.1(A) R39.2
NetD16_1: D16.1(A) R40.2
NetD17_1: D17.1(A) R41.2
NetD18_1: D18.1(A) R42.2
NetD19_1: D19.1(A) R43.2
NetD20_1: D20.1(A) R48.2
NetD21_1: D21.1(A) R49.2

### Notes on the sheet
- PB3
- PB8
- PE6
- PE4
- PE2
- PE0
- PE5
- PE3
- PE1
- PA8
- PC9
- PE15
- PE13
- PE14

### Library data of the parts
D8-D21 = LED1: Green LED,Output indicate.; Published: 8-Jun-2000; LatestRevisionDate: 08-Jul-2005; LatestRevisionNote: Mech Layer 1 removed.; PackageReference: LED-1; Publisher: Altium Limited
R26-R31 R38-R43 R48 R49 = Res1: Resistor; Value: 10K; Published: 8-Jun-2000; LatestRevisionDate: 17-Jul-2002; LatestRevisionNote: Re-released for DXP Platform.; PackageReference: AXIAL-0.3; Publisher: Altium Limited

## Sheet cpuadcinput.SchDoc
size A4
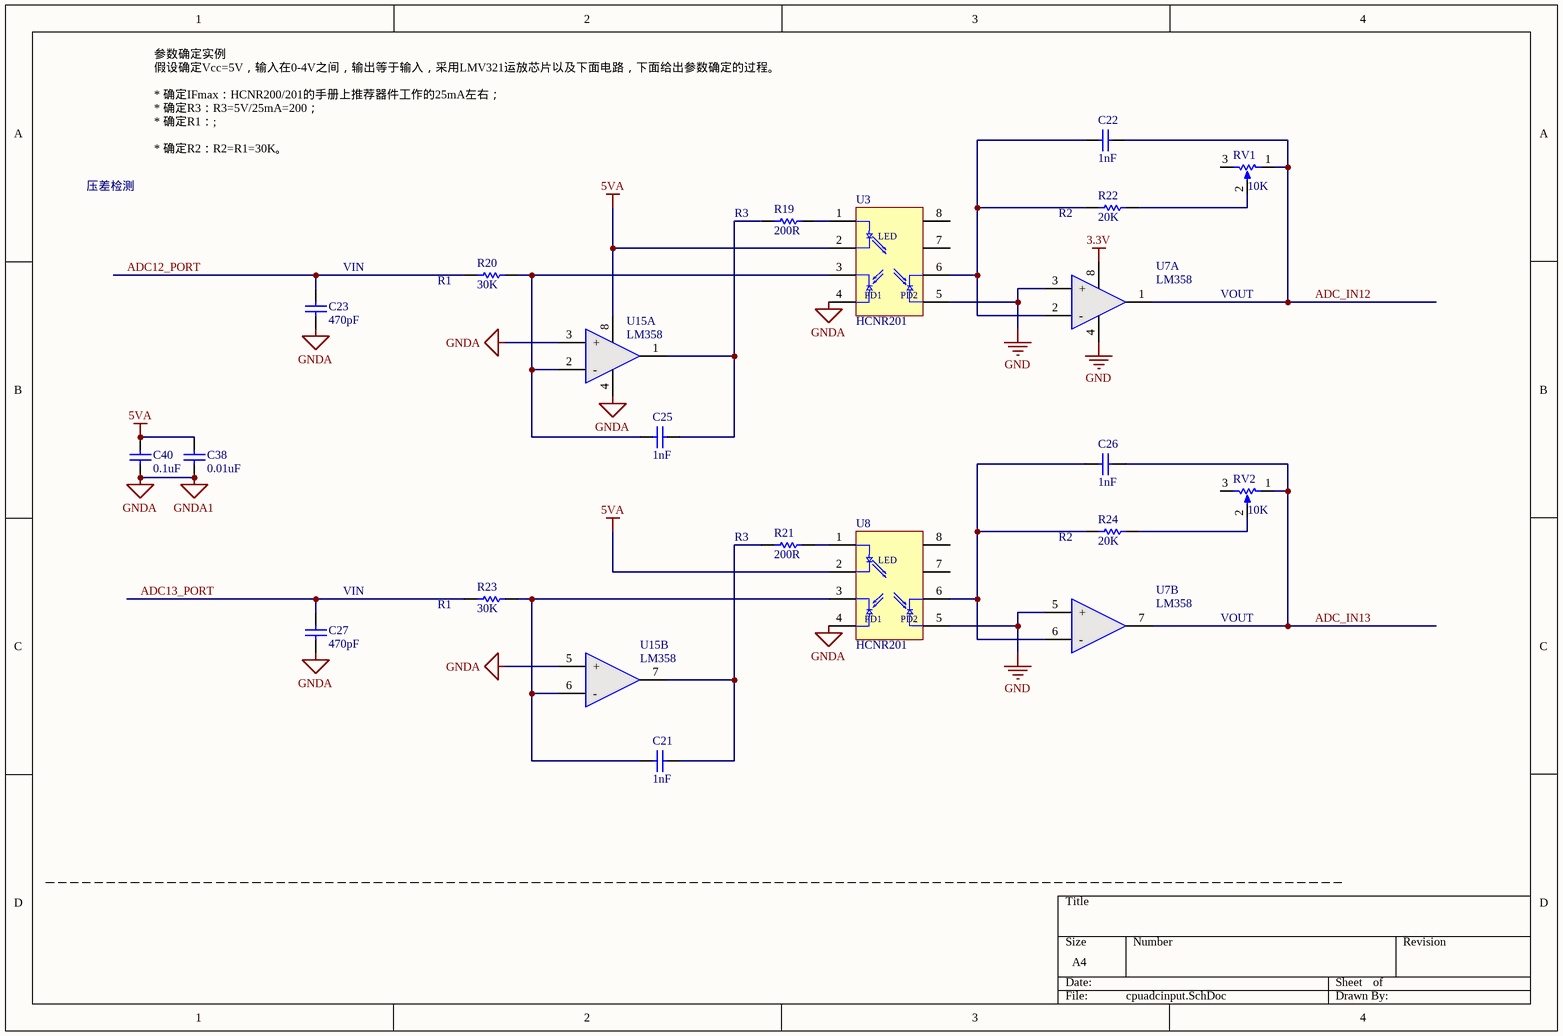
[diagram p4: cpuadcinput.SchDoc]

### Parts
C21  1nF  [CAPC2012M]
C22  1nF  [CAPC2012M]
C23  470pF  [CAPC2012M]
C25  1nF  [CAPC2012M]
C26  1nF  [CAPC2012M]
C27  470pF  [CAPC2012M]
C38  0.01uF  [CAPC2012M]
C40  0.1uF  [CAPC2012M]
R19  200R  [RESC2012M]
R20  30K  [RESC2012M]
R21  200R  [RESC2012M]
R22  20K  [RESC2012M]
R23  30K  [RESC2012M]
R24  20K  [RESC2012M]
RV1  10K  [3224W]
RV2  10K  [3224W]
U3  HCNR201  [SO8WL]
U7  LM358  [NSO8_N]  (parts A,B of 2)
U8  HCNR201  [SO8WL]
U15  LM358  [NSO8_N]  (parts A,B of 2)

### Nets
3.3V: U7.8(V+)
5VA: C38.2 C40.2 U3.2(ANODE) U8.2(ANODE) U15.8(V+)
GND: U3.5(GND) U7.3(+) U7.4(V-) U7.5(+) U8.5(GND)
GNDA: C23.1 C27.1 C38.1 C40.1 U3.4(NC) U8.4(NC) U15.3(+) U15.4(V-) U15.5(+)  [also labelled GNDA1]
ADC12_PORT: C23.2 R20.2
ADC13_PORT: C27.2 R23.2
ADC_IN12: C22.2 RV1.1(TOP) U7.1(OUT1)
ADC_IN13: C26.2 RV2.1(TOP) U7.7(OUT2)
NetC21_1: C21.1 R23.1 U8.3(CATHODE) U15.6(-)
NetC21_2: C21.2 R21.1 U15.7(OUT2)
NetC22_1: C22.1 R22.2 U3.6(Vo) U7.2(-)
NetC25_1: C25.1 R20.1 U3.3(CATHODE) U15.2(-)
NetC25_2: C25.2 R19.1 U15.1(OUT1)
NetC26_1: C26.1 R24.2 U7.6(-) U8.6(Vo)
NetR19_2: R19.2 U3.1(NC)
NetR21_2: R21.2 U8.1(NC)
NetR22_1: R22.1 RV1.2(TAP)
NetR24_1: R24.1 RV2.2(TAP)

Not connected (* = marked no-connect by the designer): RV1 3(BOT); RV2 3(BOT); U3 7(VL) 8(VCC); U8 7(VL) 8(VCC)

### Notes on the sheet
- 参数确定实例 
  假设确定Vcc=5V，输入在0-4V之间，输出等于输入，采用LMV321运放芯片以及下面电路，下面给出参数确定的过程。
  * 确定IFmax：HCNR200/201的手册上推荐器件工作的25mA左右； 
  * 确定R3：R3=5V/25mA=200；
  * 确定R1：; 
  * 确定R2：R2=R1=30K。 
  VOUT/VIN = R2/R1.
- 压差检测
- (near R19) R3
- (near R22) R2
- (near C23) VIN
- (near R20) R1
- VOUT
- (near R21) R3
- (near R24) R2
- (near C27) VIN
- (near R23) R1
- (in symbol HCNR200/201) LED; PD1; PD2

### Library data of the parts
C21 C22 C25 C26 = Cap: Capacitor; Published: 8-Jun-2000; LatestRevisionDate: 17-Jul-2002; LatestRevisionNote: Re-released for DXP Platform.; PackageReference: RAD-0.3; Publisher: Altium Limited; Value: 1nF
C23 C27 C38 C40 = Cap: Capacitor; Value: 1nF; Published: 8-Jun-2000; LatestRevisionDate: 17-Jul-2002; LatestRevisionNote: Re-released for DXP Platform.; PackageReference: RAD-0.3; Publisher: Altium Limited
R19-R24 = Res1: Resistor; Value: 10K; Published: 8-Jun-2000; LatestRevisionDate: 17-Jul-2002; LatestRevisionNote: Re-released for DXP Platform.; PackageReference: AXIAL-0.3; Publisher: Altium Limited
RV1 RV2 = RPot-A: Potentiometer; Sim Note: Enter the Resistance value and the set point into parameter fields.; Set Position: 0.5; Value: 1K; Published: 8-Jun-2000; LatestRevisionDate: 17-Jul-2002; LatestRevisionNote: Re-released for DXP Platform.; PackageReference: VR5; Publisher: Altium Limited
U3 U8 = HCNR200/201: High-Linearity Analog  Optocouplers
U7 U15 = LM358: 双运放

## Sheet cpupwrbackup.SchDoc: JKA 2.0 原理图
size A4; Author: JACK; CompanyName: 北京康洁之晨水处理技术有限公司; DrawnBy: 郭相炳; Organization: 北京康洁; DocumentNumber: 6; Revision: 2.0; SheetNumber: 6; SheetTotal: 6; ImagePath: E:\JKAdoc\data\LOGO.jpg; ProjectName: JKA2.0
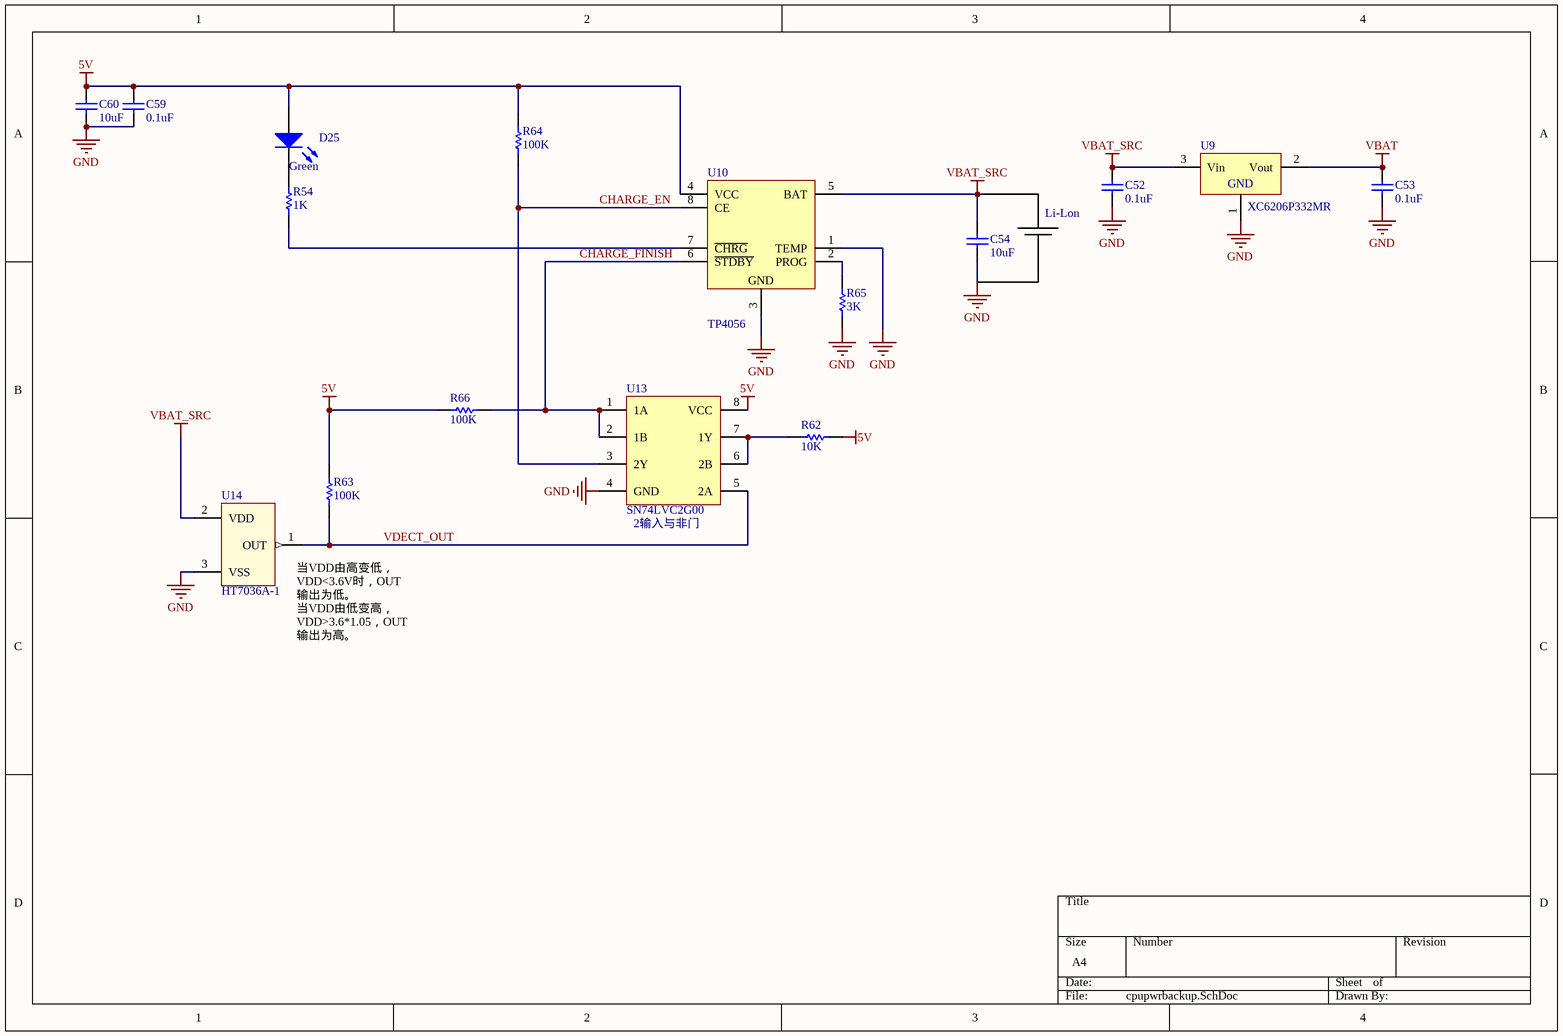
[diagram p5: cpupwrbackup.SchDoc]

### Parts
C52  0.1uF  [CAPC2012M]
C53  0.1uF  [CAPC2012M]
C54  10uF  [CAPC2012M]
C59  0.1uF  [CAPC2012M]
C60  10uF  [CAPC2012M]
D25  Green  [CD2012-0805]
R54  1K  [RESC2012M]
R62  10K  [RESC2012M]
R63  100K  [RESC2012M]
R64  100K  [RESC2012M]
R65  3K  [RESC2012M]
R66  100K  [RESC2012M]
U9  XC6206P332MR  [SOT-23_M]
U10  TP4056  [NSO8_TP4056]
U13  SN74LVC2G00  [PDSO-G8]
U14  HT7036A-1  [SOT89M]

### Nets
5V: C59.1 C60.1 D25.1(A) R62.1 R63.2 R64.2 R66.2 U10.4(VCC) U13.8(VCC)
GND: C52.2 C53.2 C54.2 C59.2 C60.2 R65.1 U9.1(GND) U10.1(TEMP) U10.3(GND) U13.4(GND) U14.3(VSS)
VBAT: C53.1 U9.2(Vout)
VBAT_SRC: C52.1 C54.1 U9.3(Vin) U10.5(BAT) U14.2(VDD)
CHARGE_EN: R64.1 U10.8(CE) U13.3(2Y)
CHARGE_FINISH: R66.1 U10.6(~{STDBY}) U13.1(1A) U13.2(1B)
VDECT_OUT: R63.1 U13.5(2A) U14.1(OUT)
NetD25_2: D25.2(K) R54.1
NetR54_2: R54.2 U10.7(~{CHRG})
NetR62_2: R62.2 U13.6(2B) U13.7(1Y)
NetR65_2: R65.2 U10.2(PROG)

### Notes on the sheet
- (near C52) Li-Lon
- (near U13) 2输入与非门
- (near U14) 当VDD由高变低，VDD<3.6V时，OUT输出为低。
  当VDD由低变高，VDD>3.6*1.05，OUT输出为高。

### Library data of the parts
C52-C54 C59 C60 = Cap: Capacitor; Value: 1nF; Published: 8-Jun-2000; LatestRevisionDate: 17-Jul-2002; LatestRevisionNote: Re-released for DXP Platform.; PackageReference: RAD-0.3; Publisher: Altium Limited
D25 = LED1: Green LED,Output indicate.; Published: 8-Jun-2000; LatestRevisionDate: 08-Jul-2005; LatestRevisionNote: Mech Layer 1 removed.; PackageReference: LED-1; Publisher: Altium Limited
R54 R63-R66 = Res1: Resistor; Value: 10K; Published: 8-Jun-2000; LatestRevisionDate: 17-Jul-2002; LatestRevisionNote: Re-released for DXP Platform.; PackageReference: AXIAL-0.3; Publisher: Altium Limited
R62 = Res1: Resistor; Published: 8-Jun-2000; LatestRevisionDate: 17-Jul-2002; LatestRevisionNote: Re-released for DXP Platform.; PackageReference: AXIAL-0.3; Publisher: Altium Limited; Value: 10K
U9 = XC6206: 250mA Low ESR Dropout Linear Regulator
U10 = TP4056: 锂电池充电管理
U13 = SN74LVC2G00: Dual 2-input positive-NAND gate
U14 = HT70XX

## Nets that join several sheets
3.3V: cpucore (18 pins), cpuinterface (25 pins), cpuledin (14 pins), cpuledout (14 pins), cpuadcinput (U7.8)
5V: cpuinterface (5 pins), cpupwrbackup (9 pins)
5VA: cpuinterface (P1.1), cpuadcinput (5 pins)
GND: cpucore (19 pins), cpuinterface (42 pins), cpuadcinput (5 pins), cpupwrbackup (11 pins)
GNDA: cpuinterface (P1.2), cpuadcinput (9 pins)
VBAT: cpucore (U1.6), cpupwrbackup (C53.1 U9.2)
VBAT_SRC: cpuinterface (C24.1 P1.21), cpupwrbackup (5 pins)
VDDA: cpucore (U1.22), cpuinterface (C30.2 C31.2 LR1.2 U4.1)
VREF: cpucore (U1.21), cpuinterface (C28.2 C29.2 U4.2)
ADC12_PORT: cpuinterface (P1.3), cpuadcinput (C23.2 R20.2)
ADC13_PORT: cpuinterface (P1.4), cpuadcinput (C27.2 R23.2)
ADC_IN12: cpucore (U1.17), cpuadcinput (C22.2 RV1.1 U7.1)
ADC_IN13: cpucore (U1.18), cpuadcinput (C26.2 RV2.1 U7.7)
BOOT0: cpucore (U1.94), cpuinterface (R2.1)
BOOT1: cpucore (U1.37), cpuinterface (R3.1)
CAN1_RX: cpucore (U1.81), cpuinterface (P1.19)
CAN1_TX: cpucore (U1.82), cpuinterface (P1.20)
DETECT_IN1: cpucore (U1.93), cpuinterface (P2.3), cpuledin (D3.2 D34.2)
DETECT_IN2: cpucore (U1.54), cpuinterface (P2.4), cpuledin (D4.2 D35.2)
DETECT_IN3: cpucore (U1.35), cpuinterface (P2.5), cpuledin (D5.2 D36.2)
DETECT_IN4: cpucore (U1.23), cpuinterface (P2.6), cpuledin (D6.2 D37.2)
DETECT_IN5: cpucore (U1.26), cpuinterface (P2.7), cpuledin (D7.2 D38.2)
DETECT_IN6: cpucore (U1.36), cpuinterface (P2.8), cpuledin (D24.2 D39.2)
DETECT_IN7: cpucore (U1.38), cpuinterface (P2.9), cpuledin (D26.2 D40.2)
DETECT_IN8: cpucore (U1.39), cpuinterface (P2.10), cpuledin (D27.2 D41.2)
DETECT_IN9: cpucore (U1.40), cpuinterface (P2.11), cpuledin (D28.2 D42.2)
DETECT_IN10: cpucore (U1.41), cpuinterface (P2.12), cpuledin (D29.2 D43.2)
DETECT_IN11: cpucore (U1.42), cpuinterface (P2.13), cpuledin (D30.2 D44.2)
DETECT_IN12: cpucore (U1.43), cpuinterface (P2.14), cpuledin (D31.2 D45.2)
DP_TIM_CAP_IN: cpucore (U1.47), cpuinterface (P2.2), cpuledin (D1.2 D32.2)
ETH_PHY_MDIO: cpucore (U1.25), cpuinterface (P1.8)
ETH_PHY_RST: cpucore (U1.15), cpuinterface (P1.11)
ETH_REF_CLK: cpucore (U1.24), cpuinterface (P1.9)
ETH_RMII_CRS_DV: cpucore (U1.32), cpuinterface (P1.7)
ETH_RMII_MDC: cpucore (U1.16), cpuinterface (P1.10)
ETH_RMII_RXD0: cpucore (U1.33), cpuinterface (P1.6)
ETH_RMII_RXD1: cpucore (U1.34), cpuinterface (P1.5)
ETH_RMII_TX_EN: cpucore (U1.48), cpuinterface (P1.14)
ETH_RMII_TXD0: cpucore (U1.51), cpuinterface (P1.16)
ETH_RMII_TXD1: cpucore (U1.52), cpuinterface (P1.13)
KEY_DOWN: cpucore (U1.58), cpuinterface (P7.4)
KEY_ENTER: cpucore (U1.62), cpuinterface (P7.8)
KEY_INT: cpucore (U1.65), cpuinterface (P7.9)
KEY_LEFT: cpucore (U1.59), cpuinterface (P7.5)
KEY_RIGHT: cpucore (U1.60), cpuinterface (P7.6)
KEY_UP: cpucore (U1.57), cpuinterface (P7.3)
LCD_RESET: cpucore (U1.61), cpuinterface (P7.7)
PORT_INT: cpucore (U1.53), cpuledin (14 pins)
RCC_OSC32_IN: cpucore (U1.8), cpuinterface (C34.1 Y2.1)
RCC_OSC32_OUT: cpucore (U1.9), cpuinterface (C35.1 Y2.2)
RCC_OSC_IN: cpucore (U1.12), cpuinterface (C32.1 Y1.1)
RCC_OSC_OUT: cpucore (U1.13), cpuinterface (C33.1 Y1.2)
RMT_STARTUP_IN: cpucore (U1.85), cpuinterface (P2.1), cpuledin (D2.2 D33.2)
SPI1_LCD_A0: cpucore (U1.71), cpuinterface (P7.13)
SPI1_LCD_BL: cpucore (U1.70), cpuinterface (P7.14)
SPI1_LCD_MISO: cpucore (U1.31), cpuinterface (R32.1)
SPI1_LCD_MOSI: cpucore (U1.91), cpuinterface (R25.1)
SPI1_LCD_NSS: cpucore (U1.29), cpuinterface (P7.10)
SPI1_LCD_SCK: cpucore (U1.30), cpuinterface (P7.11)
SPI3_FLASH_NSS: cpucore (U1.77), cpuinterface (U6.1)
SPI3_MISO: cpucore (U1.79), cpuinterface (TF1.7 U6.2)
SPI3_MOSI: cpucore (U1.80), cpuinterface (TF1.3 U6.5)
SPI3_SCK: cpucore (U1.78), cpuinterface (TF1.5 U6.6)
SPI3_TF_CD: cpucore (U1.84), cpuinterface (R1.1 TF1.9)
SPI3_TF_NSS: cpucore (U1.83), cpuinterface (TF1.2)
SUB_SYS_BOOTSEL: cpucore (U1.88), cpuinterface (P1.22)
SUB_SYS_RST: cpucore (U1.92), cpuinterface (P1.17)
SYS_NRST: cpucore (U1.14), cpuinterface (R5.1 U5.2)
SYS_SWCLK: cpucore (U1.76), cpuinterface (P5.3)
SYS_SWDIO: cpucore (U1.72), cpuinterface (P5.2)
USART1_PC_RX: cpucore (U1.69), cpuinterface (R60.2)
USART1_PC_TX: cpucore (U1.68), cpuinterface (R59.1)
USART2_EXT_RX: cpucore (U1.87), cpuinterface (R58.1)
USART2_EXT_TX: cpucore (U1.86), cpuinterface (R57.1)
USART6_WIFI_LINK: cpucore (U1.89), cpuledout (D8.2)
USART6_WIFI_PROG: cpucore (U1.90), cpuinterface (R61.2 U11.12)
USART6_WIFI_RX: cpucore (U1.64), cpuinterface (U11.16)
USART6_WIFI_TX: cpucore (U1.63), cpuinterface (U11.15)
USART_DP_LINK: cpucore (U1.95), cpuledout (D9.2)
USART_DP_RX: cpucore (U1.56), cpuinterface (P1.15)
USART_DP_TX: cpucore (U1.55), cpuinterface (P1.18)
VDLY_DRIVER: cpucore (U1.3), cpuinterface (P2.27), cpuledout (D11.2)
VDRIVER_OUT1: cpucore (U1.1), cpuinterface (P2.26), cpuledout (D12.2)
VDRIVER_OUT2: cpucore (U1.97), cpuinterface (P2.25), cpuledout (D13.2)
VDRIVER_OUT3: cpucore (U1.4), cpuinterface (P2.24), cpuledout (D14.2)
VDRIVER_OUT4: cpucore (U1.2), cpuinterface (P2.23), cpuledout (D15.2)
VDRIVER_OUT5: cpucore (U1.98), cpuinterface (P2.22), cpuledout (D16.2)
VDRIVER_OUT6: cpucore (U1.67), cpuinterface (P2.21), cpuledout (D17.2)
VDRIVER_OUT7: cpucore (U1.66), cpuinterface (P2.20), cpuledout (D18.2)
VDRIVER_OUT8: cpucore (U1.46), cpuinterface (P2.18), cpuledout (D19.2)
VDRIVER_OUT9: cpucore (U1.45), cpuinterface (P2.15), cpuledout (D20.2)
VDRIVER_OUT10: cpucore (U1.44), cpuinterface (P2.16), cpuledout (D21.2)
VMAIN_DRIVER: cpucore (U1.5), cpuinterface (P2.28), cpuledout (D10.2)